# EAGLE schematic esp32buscam_03 (EAGLE 9.6.2)
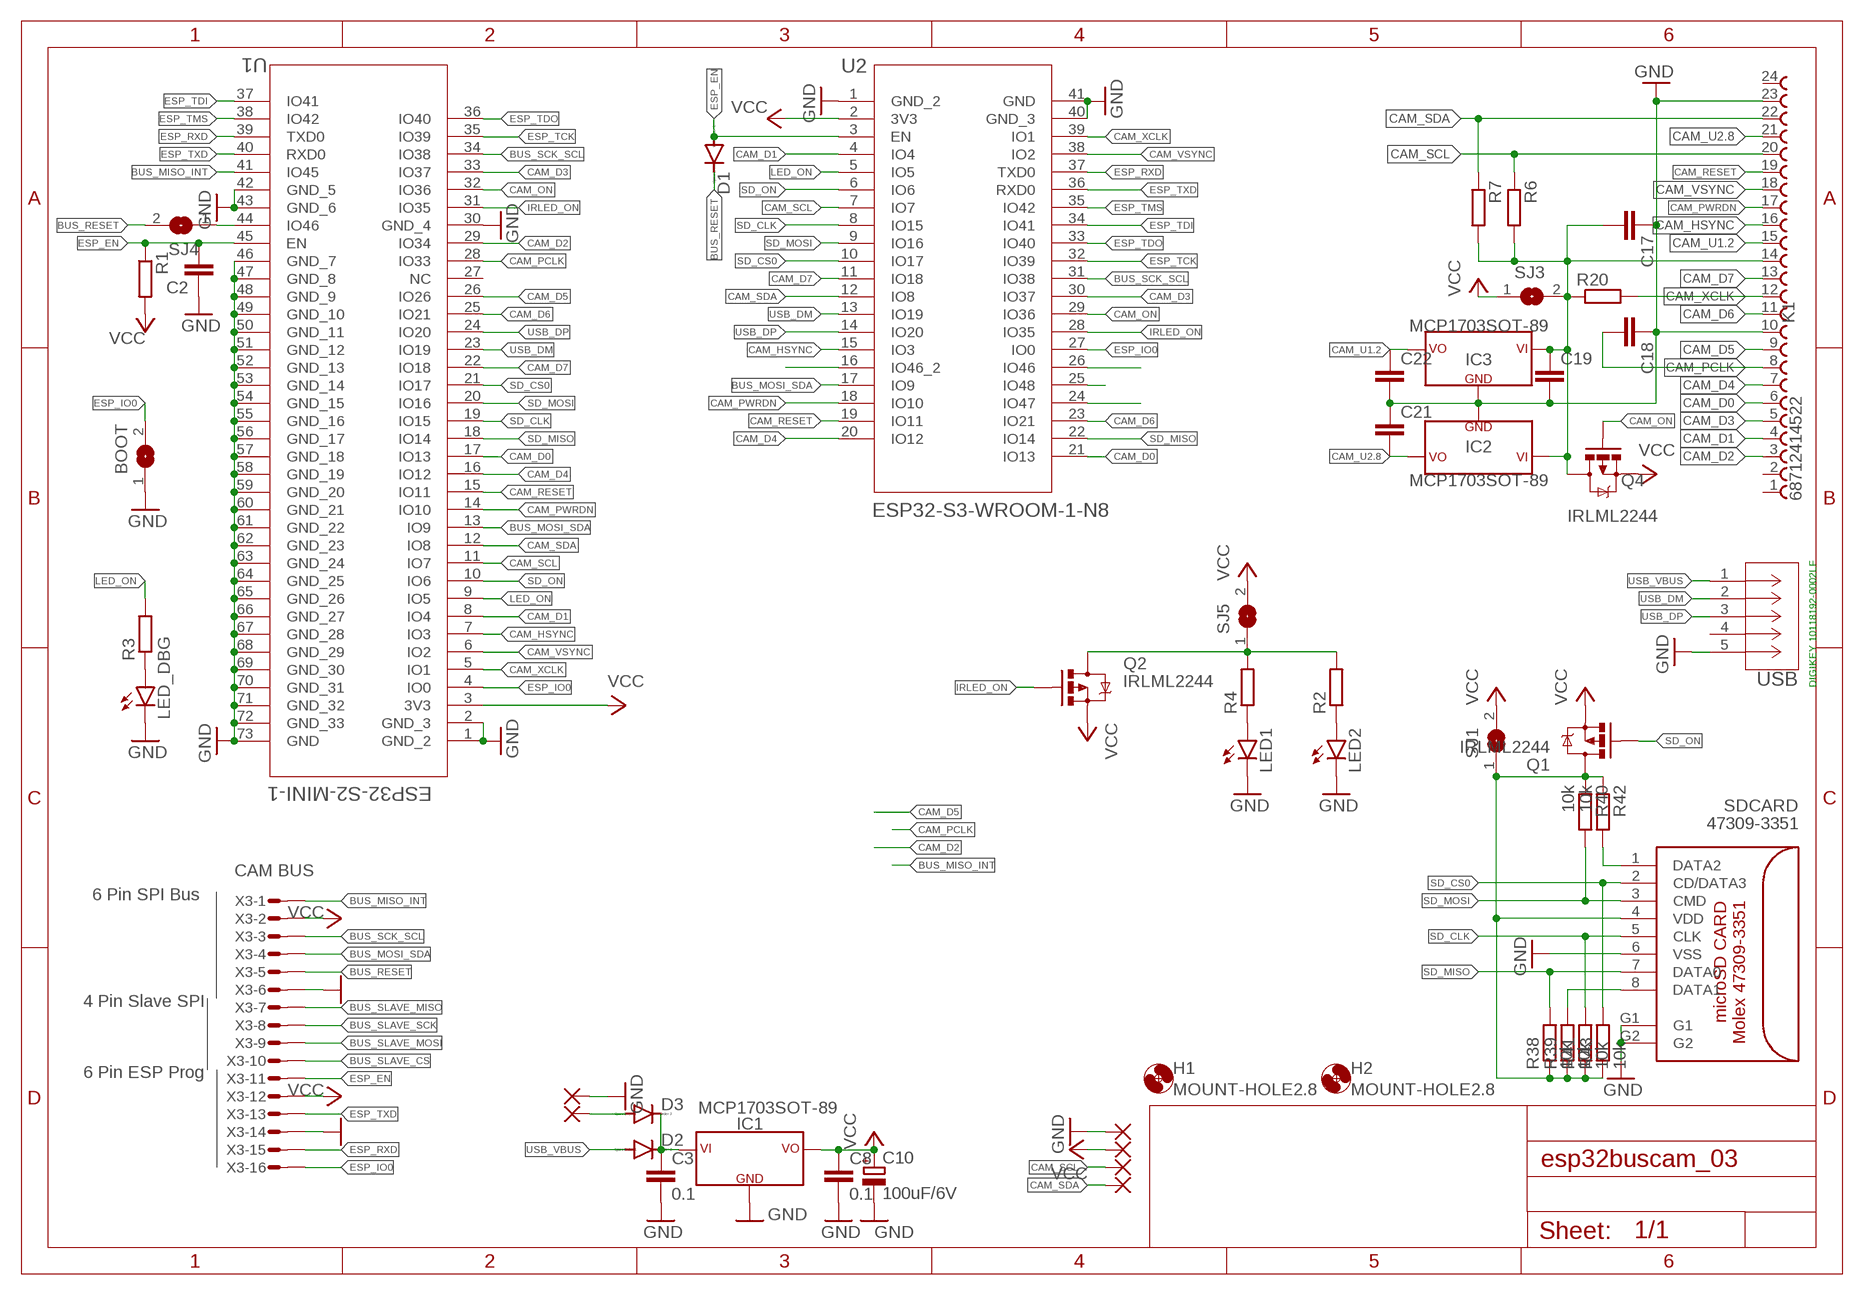
[diagram p0: schematic, sheet 1]

## Parts
BOOT  SJ  [SJ]
C2  C-EUC0603  [C0603]
C3  0.1  C-EUC0805  [C0805]
C8  0.1  C-EUC0805  [C0805]
C10  100uF/6V  CPOL-EUB/3528-21R  [B/3528-21R]
C17  C-EUC0603  [C0603]
C18  C-EUC0603  [C0603]
C19  C-EUC0603  [C0603]
C21  C-EUC0603  [C0603]
C22  C-EUC0603  [C0603]
D1  DIODE-MINIMELF  [MINIMELF]
D2  DIODE-MINIMELF  [MINIMELF]
D3  DIODE-MINIMELF  [MINIMELF]
H1  MOUNT-HOLE2.8  [2,8]
H2  MOUNT-HOLE2.8  [2,8]
IC1  MCP1703SOT-89  [SOT89]
IC2  MCP1703SOT-89  [SOT89]
IC3  MCP1703SOT-89  [SOT89]
K1  68712414522  [68712414522]
LED1  LED5MM  [LED5MM]
LED2  LED5MM  [LED5MM]
LED_DBG  G  LEDCHIPLED_0805  [CHIPLED_0805]
PAD1  1,6/0,9  [1,6/0,9]
PAD2  1,6/0,9  [1,6/0,9]
PAD3  1,6/0,9  [1,6/0,9]
PAD4  1,6/0,9  [1,6/0,9]
PAD5  1,6/0,9  [1,6/0,9]
PAD6  1,6/0,9  [1,6/0,9]
Q1  IRLML2244  MOSFET-PCHANNELIRLML2244  [SOT23-3]
Q2  IRLML2244  MOSFET-PCHANNELIRLML2244  [SOT23-3]
Q4  IRLML2244  MOSFET-PCHANNELIRLML2244  [SOT23-3]
R1  R-EU_R0603  [R0603]
R2  R-EU_R0402  [R0402]
R3  R-EU_R0402  [R0402]
R4  R-EU_R0402  [R0402]
R6  R-EU_R0603  [R0603]
R7  R-EU_R0603  [R0603]
R20  R-EU_R0603  [R0603]
R38  10k  R-EU_R0805  [R0805]
R39  10k  R-EU_R0805  [R0805]
R40  10k  R-EU_R0805  [R0805]
R41  10k  R-EU_R0805  [R0805]
R42  10k  R-EU_R0805  [R0805]
R43  10k  R-EU_R0805  [R0805]
SDCARD  47309-3351  [47309-3351]
SJ1  SJ  [SJ]
SJ3  SJ  [SJ]
SJ4  SJ  [SJ]
SJ5  SJ  [SJ]
U1  ESP32-S2-MINI-1  [QFN60_ESP32-S2-MINI-1_EXP]
U2  ESP32-S3-WROOM-1-N8  [ESP32-S3-WROOM-1-N8_EXP]
USB  10118192-0002LF  [CONN_10118192-0002LF_AMP]
X3  CAM BUS  MICROMATCH-16SMD  [MICROMATCH-16SMD]

## Nets
BUS_MISO_INT: U1.41(IO45) X3.16
BUS_MOSI_SDA: U1.13(IO9) U2.17(IO9) X3.13
BUS_RESET: D1.C SJ4.2 X3.12
BUS_SCK_SCL: U1.34(IO38) U2.31(IO38) X3.14
BUS_SLAVE_CS: X3.7
BUS_SLAVE_MISO: X3.10
BUS_SLAVE_MOSI: X3.8
BUS_SLAVE_SCK: X3.9
CAM_D0: K1.6 U1.17(IO13) U2.21(IO13)
CAM_D1: K1.4 U1.8(IO4) U2.4(IO4)
CAM_D2: K1.3 U1.29(IO34)
CAM_D3: K1.5 U1.33(IO37) U2.30(IO37)
CAM_D4: K1.7 U1.16(IO12) U2.20(IO12)
CAM_D5: K1.9 U1.26(IO26)
CAM_D6: K1.11 U1.25(IO21) U2.23(IO21)
CAM_D7: K1.13 U1.22(IO18) U2.11(IO18)
CAM_HSYNC: K1.16 U1.7(IO3) U2.15(IO3)
CAM_ON: Q4.1(G) U1.32(IO36) U2.29(IO36)
CAM_PCLK: C18.2 K1.8 U1.28(IO33)
CAM_PWRDN: K1.17 U1.14(IO10) U2.18(IO10)
CAM_RESET: K1.19 U1.15(IO11) U2.19(IO11)
CAM_SCL: K1.20 PAD3.1(P) R6.1 U1.11(IO7) U2.7(IO7)
CAM_SDA: K1.22 PAD4.1(P) R7.1 U1.12(IO8) U2.12(IO8)
CAM_U1.2: C22.1 IC3.3(VCC) K1.15
CAM_U2.8: C21.2 IC2.3(VCC) K1.21
CAM_VSYNC: K1.18 U1.6(IO2) U2.38(IO2)
CAM_XCLK: K1.12 R20.2 U1.5(IO1) U2.39(IO1)
ESP_EN: C2.2 D1.A R1.1 U1.45(EN) U2.3(EN) X3.6
ESP_IO0: BOOT.2 U1.4(IO0) U2.27(IO0) X3.1
ESP_RXD: U1.39(TXD0) U2.37(TXD0) X3.2
ESP_TCK: U1.35(IO39) U2.32(IO39)
ESP_TDI: U1.37(IO41) U2.34(IO41)
ESP_TDO: U1.36(IO40) U2.33(IO40)
ESP_TMS: U1.38(IO42) U2.35(IO42)
ESP_TXD: U1.40(RXD0) U2.36(RXD0) X3.4
GND [gnd]: BOOT.1 C2.1 C3.2 C8.2 C10.- C17.1 C18.1 C19.2 C21.1 C22.2 IC1.1(GND) IC2.1(GND) IC3.1(GND) K1.10 K1.23 LED1.K(C) LED2.K(C) LED_DBG.C PAD1.1(P) PAD6.1(P) SDCARD.6(VSS) SDCARD.G1 SDCARD.G2 U1.1(GND_2) U1.2(GND_3) U1.30(GND_4) U1.42(GND_5) U1.43(GND_6) U1.46(GND_7) U1.47(GND_8) U1.48(GND_9) U1.49(GND_10) U1.50(GND_11) U1.51(GND_12) U1.52(GND_13) U1.53(GND_14) U1.54(GND_15) U1.55(GND_16) U1.56(GND_17) U1.57(GND_18) U1.58(GND_19) U1.59(GND_20) U1.60(GND_21) U1.61(GND_22) U1.62(GND_23) U1.63(GND_24) U1.64(GND_25) U1.65(GND_26) U1.66(GND_27) U1.67(GND_28) U1.68(GND_29) U1.69(GND_30) U1.70(GND_31) U1.71(GND_32) U1.72(GND_33) U1.73(GND) U2.1(GND_2) U2.40(GND_3) U2.41(GND) USB.5 X3.3 X3.11
IRLED_ON: Q2.1(G) U1.31(IO35) U2.28(IO35)
LED_ON: R3.2 U1.9(IO5) U2.5(IO5)
N$1: LED1.A R4.1
N$2: SJ4.1 U1.44(IO46)
N$3: LED2.A R2.1
N$4: LED_DBG.A R3.1
N$8: Q2.3(D) R2.2 R4.2 SJ5.1
N$19: U2.16(IO46_2)
N$37: U2.26(IO46)
N$38: U2.25(IO48)
N$39: U2.24(IO47)
SD_CLK: R41.2 SDCARD.5(CLK) U1.19(IO15) U2.8(IO15)
SD_CS0: R43.2 SDCARD.2(CD/DATA3) U1.21(IO17) U2.10(IO17)
SD_D1: R39.2 SDCARD.8(DATA1)
SD_D2: R42.2 SDCARD.1(DATA2)
SD_MISO: R38.2 SDCARD.7(DATA0) U1.18(IO14) U2.22(IO14)
SD_MOSI: R40.2 SDCARD.3(CMD) U1.20(IO16) U2.9(IO16)
SD_ON: Q1.1(G) U1.10(IO6) U2.6(IO6)
U3.3 [power]: Q1.3(D) R38.1 R39.1 R40.1 R41.1 R42.1 R43.1 SDCARD.4(VDD) SJ1.1
USB_DM: U1.23(IO19) U2.13(IO19) USB.2
USB_DP: U1.24(IO20) U2.14(IO20) USB.3
USB_VBUS [power]: D2.A USB.1
V [power]: C3.1 D2.C D3.C IC1.2(VIN) IC1.4(VIN)
VCC [power]: C8.1 C10.+ IC1.3(VCC) PAD2.1(P) Q1.2(S) Q2.2(S) Q4.2(S) R1.2 SJ1.2 SJ3.1 SJ5.2 U1.3(3V3) U2.2(3V3) X3.5 X3.15
VCC_CAM [power]: C17.2 C19.1 IC2.2(VIN) IC2.4(VIN) IC3.2(VIN) IC3.4(VIN) K1.14 Q4.3(D) R6.2 R7.2 R20.1 SJ3.2
VEXT: D3.A PAD5.1(P)
Unconnected: K1.1 K1.2 K1.24 U1.27(NC) USB.4

## Notes on the sheet
- DIGIKEY 10118192-0002LF
- 6 Pin SPI Bus
- 4 Pin Slave SPI
- 6 Pin ESP Prog

## Library data of the parts
BOOT SJ1 SJ3-SJ5 = jumper:SJ: SMD solder JUMPER
C2 C17-C19 C21 C22 = rcl:C-EU: CAPACITOR, European symbol; SPICEPREFIX: C
C3 C8 = rcl:C-EU: CAPACITOR, European symbol
C10 = rcl:CPOL-EU: POLARIZED CAPACITOR, European symbol
D1-D3 = diode:DIODE-: DIODE
H1 H2 = holes:MOUNT-HOLE: MOUNTING HOLE with drill center marker
IC1-IC3 = bytewerk-vreg:MCP1703
K1 = FPC_Connectors_Flat_Flexible_Cable_rev15c:68712414522: WE-FPC 0.5mm SMT ZIF Horizontal Bottom Contact, 24 Pins=>Code : Con_FPC_ZIF_0.50_68712414522 <http://katalog.we-online.de/media/images/eican/Con_FPC_ZIF_0.50_6871xx14522_pf2.jpg> Details see: http://katalog.we-online.de/en/em/687_1xx_145_22 Created 2014-07-09, Karrer Zheng 2014 (C) Würth Elektronik
LED1 LED2 LED_DBG = led:LED: LED OSRAM: - CHIPLED LG R971, LG N971, LY N971, LG Q971, LY Q971, LO R971, LY R971 LH N974, LH R974 LS Q976, LO Q976, LY Q976 LO Q996 - Hyper CHIPLED LW Q18S LB Q993, LB Q99A, LB R99A - SideLED LS A670, LO A670, LY A670, LG A670, LP A670 LB A673, LV A673, LT A673, LW A673 LH A674 LY A675 LS A676, LA A676, LO A676, LY A676, LW A676 LS A679, LY A679, LG A679 - Hyper Micro SIDELED® LS Y876, LA Y876, LO Y876, LY Y876 LT Y87S - SmartLED LW L88C, LW L88S LB L89C, LB L89S, LG L890 LS L89K, LO L89K, LY L89K LS L896, LA L896, LO L896, LY L896 - TOPLED LS T670, LO T670, LY T670, LG T670, LP T670 LSG T670, LSP T670, LSY T670, LOP T670, LYG T670 LG T671, LOG T671, LSG T671 LB T673, LV T673, LT T673, LW T673 LH T674 LS T676, LA T676, LO T676, LY T676, LB T676, LH T676, LSB T676, LW T676 LB T67C, LV T67C, LT T67C, LS T67K, LO T67K, LY T67K, LW E67C LS E67B, LA E67B, LO E67B, LY E67B, LB E67C, LV E67C, LT E67C LW T67C LS T679, LY T679, LG T679 LS T770, LO T770, LY T770, LG T770, LP T770 LB T773, LV T773, LT T773, LW T773 LH T774 LS E675, LA E675, LY E675, LS T675 LS T776, LA T776, LO T776, LY T776, LB T776 LHGB T686 LT T68C, LB T68C - Hyper Mini TOPLED® LB M676 - Mini TOPLED Santana® LG M470 LS M47K, LO M47K, LY M47K Source: http://www.osram.convergy.de LUXEON: - LUMILED® LXK2-PW12-R00, LXK2-PW12-S00, LXK2-PW14-U00, LXK2-PW14-V00 LXK2-PM12-R00, LXK2-PM12-S00, LXK2-PM14-U00 LXK2-PE12-Q00, LXK2-PE12-R00, LXK2-PE12-S00, LXK2-PE14-T00, LXK2-PE14-U00 LXK2-PB12-K00, LXK2-PB12-L00, LXK2-PB12-M00, LXK2-PB14-N00, LXK2-PB14-P00, LXK2-PB14-Q00 LXK2-PR12-L00, LXK2-PR12-M00, LXK2-PR14-Q00, LXK2-PR14-R00 LXK2-PD12-Q00, LXK2-PD12-R00, LXK2-PD12-S00 LXK2-PH12-R00, LXK2-PH12-S00 LXK2-PL12-P00, LXK2-PL12-Q00, LXK2-PL12-R00 Source: www.luxeon.com KINGBRIGHT: KA-3528ASYC Source: www.kingbright.com
PAD1-PAD6 = wirepad:1,6/0,9: THROUGH-HOLE PAD
Q1 Q2 Q4 = User-Submitted:MOSFET-PCHANNEL: Generic PMOSFET IRLML2244 - TRANS-11153 (SOT-23 -20V -4.3A) (1.Gate 2.Source 3.Drain) FQP27P06 - COM-10349 <http://www.sparkfun.com/products/10349> (TO-220 -60V -27A) (1.Gate 2.Source 3.Drain); PROD_ID: TRANS-11153
R1-R4 R6 R7 R20 = rcl:R-EU_: RESISTOR, European symbol; SPICEPREFIX: R
R38-R43 = rcl:R-EU_: RESISTOR, European symbol
SDCARD = con-molex-microsd:47309-3351
U1 = esp32s2mini:ESP32-S2-MINI-1; BUILT_BY: EMA_Kyle; COPYRIGHT: Copyright (C) 2018 Accelerated Designs. All rights reserved; DATASHEET: https://www.espressif.com/sites/default/files/documentation/esp32-s2-mini-1_esp32-s2-mini-1u_datasheet_en.pdf; MANUFACTURER_PART_NUMBER: ESP32-S2-MINI-1; SOURCELIBRARY: Add_to_database_2020-11-03; VENDOR: Espressif Systems
U2 = ESP32S3:ESP32-S3-WROOM-1-N8; COPYRIGHT: Copyright (C) 2021 Ultra Librarian. All rights reserved.; DIGI-KEY_PART_NUMBER_1: 1965-ESP32-S3-WROOM-1-N8TR-ND; DIGI-KEY_PART_NUMBER_2: 1965-ESP32-S3-WROOM-1-N8CT-ND; DIGI-KEY_PART_NUMBER_3: 1965-ESP32-S3-WROOM-1-N8DKR-ND; MANUFACTURER_PART_NUMBER: ESP32-S3-WROOM-1-N8; MFR_NAME: Espressif Systems
USB = esp32s2mini:10118192-0002LF; BUILT_BY: EMA_Cory; COPYRIGHT: Copyright (C) 2018 Accelerated Designs. All rights reserved; DATASHEET: https://www.amphenol-icc.com/media/wysiwyg/files/drawing/10118192.pdf; MANUFACTURER_PART_NUMBER: 10118192-0002LF; SOURCELIBRARY: Amphenol_ICC_2020-05-19; VENDOR: Amphenol
X3 = Con-amp-micromatch:MICROMATCH-16: MicroMaTch 16 8-215464-6 / 1-215464-6 Drawing Number C-215464 DDEController.pdf

## Net classes
0 default: width 0.089 mm, drill 0.2 mm
1 gnd: width 0.254 mm, drill 0.2 mm
2 power: width 0.254 mm, drill 0.2 mm